# Altium schematic sheet p1.SchDoc
size A4
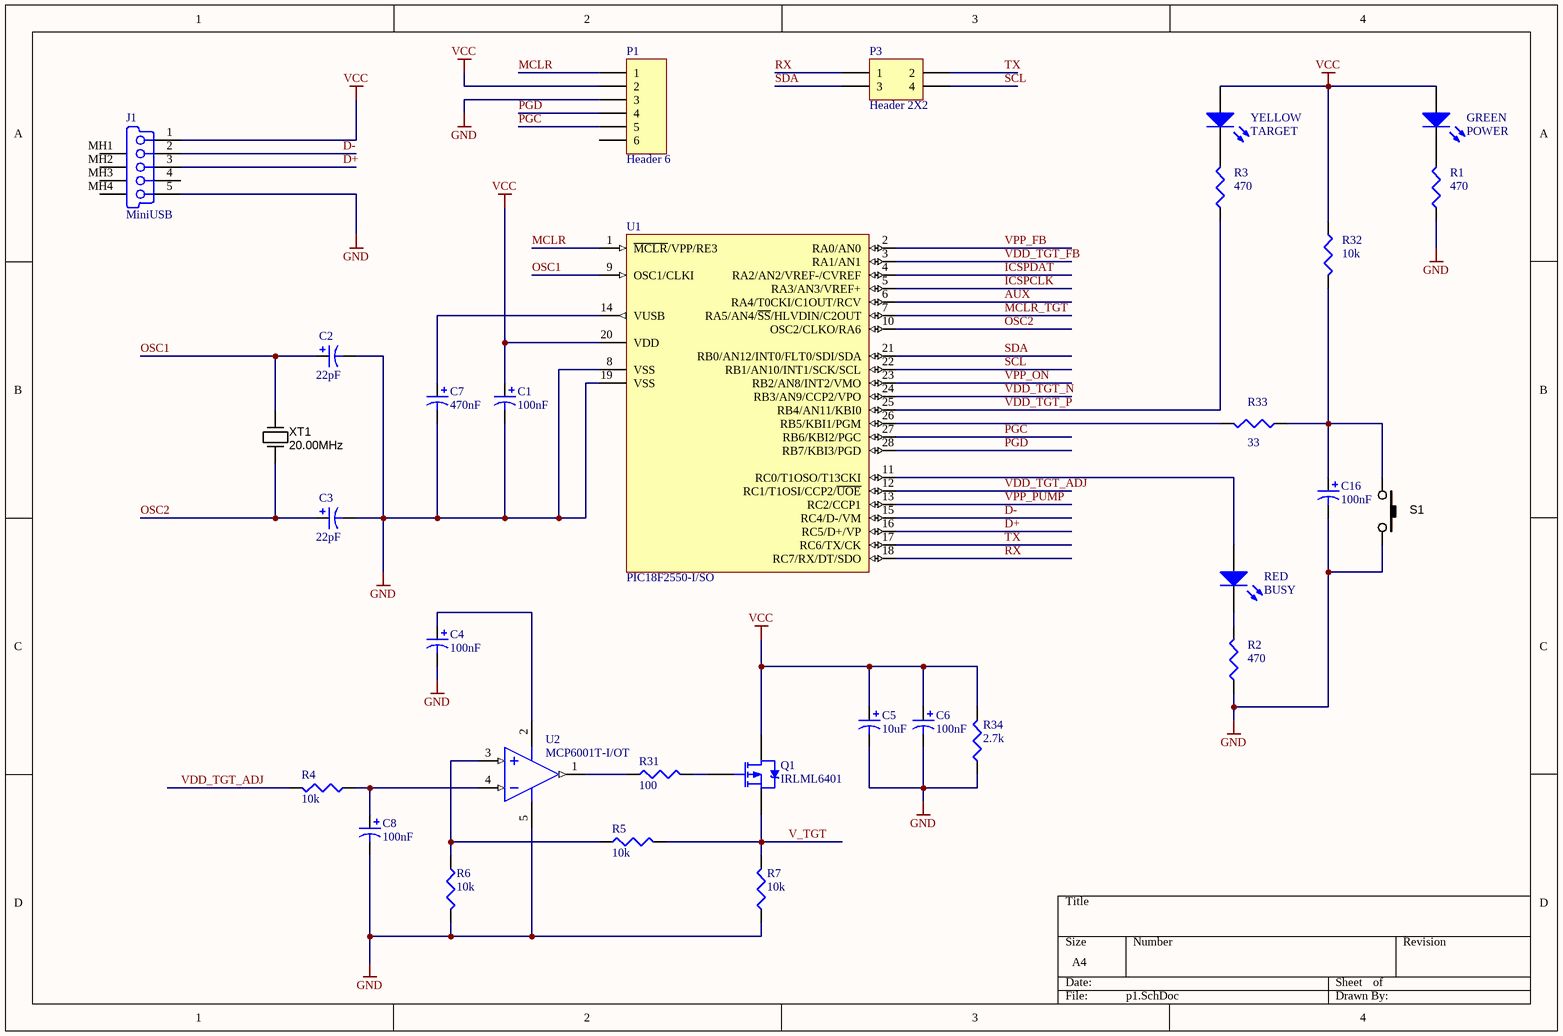
[diagram p0: p1.SchDoc]

## Parts
C1  value 100nF  [C0805]  (hidden comment: Cap Pol3)
C2  value 22pF  [C0805]  (hidden comment: Cap Pol3)
C3  value 22pF  [C0805]  (hidden comment: Cap Pol3)
C4  value 100nF  [C0805]  (hidden comment: Cap Pol3)
C5  value 10uF  [C0805]  (hidden comment: Cap Pol3)
C6  value 100nF  [C0805]  (hidden comment: Cap Pol3)
C7  value 470nF  [C0805]  (hidden comment: Cap Pol3)
C8  value 100nF  [C0805]  (hidden comment: Cap Pol3)
C16  value 100nF  [C0805]  (hidden comment: Cap Pol3)
GREEN  POWER  [3.5X2.8X1.9]
J1  MiniUSB  [microusb]
P1  Header 6  [HDR1X6]
P3  Header 2X2  [HDR2X2]
Q1  IRLML6401  [Micro3_N]
R1  value 470  [RESC2012X70N]  (hidden comment: Res3)
R2  value 470  [RESC2012X70N]  (hidden comment: Res3)
R3  value 470  [RESC2012X70N]  (hidden comment: Res3)
R4  value 10k  [RESC2012X70N]  (hidden comment: Res3)
R5  value 10k  [RESC2012X70N]  (hidden comment: Res3)
R6  value 10k  [RESC2012X70N]  (hidden comment: Res3)
R7  value 10k  [RESC2012X70N]  (hidden comment: Res3)
R31  value 100  [RESC2012X70N]  (hidden comment: Res3)
R32  value 10k  [RESC2012X70N]  (hidden comment: Res3)
R33  value 33  [RESC2012X70N]  (hidden comment: Res3)
R34  value 2.7k  [RESC2012X70N]  (hidden comment: Res3)
RED  BUSY  [3.5X2.8X1.9]
S1  TS-1143S-WP  [TS-1143S]  (value not drawn)
U1  PIC18F2550-I/SO  [SOIC-SO28_N]
U2  MCP6001T-I/OT  [SOT-23-OT5_N]
XT1  20.00MHz  [CRYSTAL_HC49-US-SM]
YELLOW  TARGET  [3.5X2.8X1.9]

## Nets
GND: C1.2 C2.2 C3.2 C4.2 C5.2 C6.2 C7.2 C8.2 C16.2 J1.5(GND) P1.3 R1.1 R2.1 R6.2 R7.1 R34.1 S1.2 U1.8(VSS) U1.19(VSS) U2.5(VDD)
VCC: C1.1 C5.1 C6.1 GREEN.1(A) J1.1(V_BUS_(5V)) P1.2 Q1.3(D) R32.1 R34.2 U1.20(VDD) YELLOW.1(A)
AUX: U1.6(RA4/T0CKI/C1OUT/RCV)
D+: J1.3(D+) U1.16(RC5/D+/VP)
D-: J1.2(D-) U1.15(RC4/D-/VM)
ICSPCLK: U1.5(RA3/AN3/VREF+)
ICSPDAT: U1.4(RA2/AN2/VREF-/CVREF)
MCLR: P1.1 U1.1(~{MCLR}/VPP/RE3)
MCLR_TGT: U1.7(RA5/AN4/~{SS}/HLVDIN/C2OUT)
OSC1: C2.1 U1.9(OSC1/CLKI) XT1.2(OUT)
OSC2: C3.1 U1.10(OSC2/CLKO/RA6) XT1.1(IN)
PGC: P1.5 U1.27(RB6/KBI2/PGC)
PGD: P1.4 U1.28(RB7/KBI3/PGD)
RX: P3.1 U1.18(RC7/RX/DT/SDO)
SCL: P3.4 U1.22(RB1/AN10/INT1/SCK/SCL)
SDA: P3.3 U1.21(RB0/AN12/INT0/FLT0/SDI/SDA)
TX: P3.2 U1.17(RC6/TX/CK)
V_TGT: Q1.2(S) R5.2 R7.2
VDD_TGT_ADJ: R4.2 U1.12(RC1/T1OSI/CCP2/~{UOE})
VDD_TGT_FB: U1.3(RA1/AN1)
VDD_TGT_N: U1.24(RB3/AN9/CCP2/VPO)
VDD_TGT_P: R3.1 U1.25(RB4/AN11/KBI0)
VPP_FB: U1.2(RA0/AN0)
VPP_ON: U1.23(RB2/AN8/INT2/VMO)
VPP_PUMP: U1.13(RC2/CCP1)
NetC4_1: C4.1 U2.2(VSS)
NetC7_1: C7.1 U1.14(VUSB)
NetC8_1: C8.1 R4.1 U2.4(VIN-)
NetC16_1: C16.1 R32.2 R33.1 S1.1
NetGREEN_2: GREEN.2(K) R1.2
NetQ1_1: Q1.1(G) R31.2
NetR2_2: R2.2 RED.2(K)
NetR3_2: R3.2 YELLOW.2(K)
NetR5_1: R5.1 R6.1 U2.3(VIN+)
NetR31_1: R31.1 U2.1(VOUT)
NetR33_2: R33.2 U1.26(RB5/KBI1/PGM)
NetRED_1: RED.1(A) U1.11(RC0/T1OSO/T13CKI)

Not connected (* = marked no-connect by the designer): J1 4(NC) MH1(Tab) MH2(Tab) MH3(Tab) MH4(Tab); P1 6

## Library data of the parts
C1-C8 C16 = Cap Pol3: Polarized Capacitor (Surface Mount); Published: 8-Jun-2000; LatestRevisionDate: 29-May-2009; LatestRevisionNote: IPC-7351 Footprint Added.; PackageReference: C0805; Publisher: Altium Limited; PackageDescription: Chip Capacitor; Supplier Part Number 1: *
GREEN RED YELLOW = LED3: Typical BLUE SiC LED; Published: 8-Jun-2000; LatestRevisionDate: 17-Dec-2003; LatestRevisionNote: PCB Footprint replaced.; DatasheetVersion: 16-Apr-2002; PackageVersion: 16-Apr-2002; PackageReference: 3.5X2.8X1.9; Publisher: Altium Limited; PackageDescription: SM LED; 2 C-Bend Leads; Body 3.5 x 2.8 x 1.9 mm, inc leads (LxWxH typ); Supplier 1: Digi-Key
  GREEN: Supplier Part Number 1: 732-4997-1-ND
  RED: Supplier Part Number 1: 732-5000-1-ND
  YELLOW: Supplier Part Number 1: 732-4995-1-ND
J1 = MicroUSB: USB On-The-Go (OTG) Mini-B Receptacle, Right Angle, SMT, 0.80mm (.031") Pitch, Solder Tabs with Back Cover, Recessed Type; PCB_Layout: Complies with Manufacturer's Recommendation.; Published: 21-Sep-2007; DatasheetVersion: revA, May-2004; PackageVersion: May-2004; PackageReference: 481900001; Publisher: Altium Limited; PackageDescription: USB Mini-B, Sinking Type, SM; 5 Position; Right Angle, Body 11.45 x 11.8 x 3.9 mm (LxWxH); ComponentLink1Description: Manufacturer Link; ComponentLink1URL: http://www.molex.com/; ComponentLink2Description: Datasheet; ComponentLink2URL: http://www.molex.com/cmc_upload/0/000/895/958/SD-48190-001RevA.pdf; Supplier Part Number 1: WM17122CT-ND; Supplier 1: Digi-Key
P1 = Header 6: Header, 6-Pin; LatestRevisionDate: 17-Jul-2002; LatestRevisionNote: Re-released for DXP Platform.; Publisher: Altium Limited; Supplier Part Number 1: S5481-ND; Supplier 1: Digi-Key
P3 = Header 2X2: Header, 2-Pin, Dual row; LatestRevisionDate: 17-Jul-2002; LatestRevisionNote: Re-released for DXP Platform.; Publisher: Altium Limited; Supplier Part Number 1: 609-3242-ND; Supplier 1: Digi-Key
Q1 = IRLML6401: HEXFET Power MOSFET; Published: 17-Sep-2003; DatasheetVersion: 2-Jul-2001; PackageVersion: Jul-2001; PackageReference: Micro3; Publisher: Altium Limited; PackageDescription: 3-Pin SOT-23 Package 0.95 mm Pitch, 2.3 mm Lead Span; ComponentLink1Description: Manufacturer Link; ComponentLink1URL: http://www.irf.com/; ComponentLink2Description: Datasheet; ComponentLink2URL: http://www.irf.com/product-info/datasheets/data/IRLML6401.pdf; Supplier Part Number 1: IRLML6401PBFCT-ND; Supplier 1: Digi-Key
R1-R7 R31-R34 = Res3: Resistor; Published: 8-Jun-2000; LatestRevisionDate: 29-May-2009; LatestRevisionNote: IPC-7351 Footprint Added.; PackageReference: J1-0603; Publisher: Altium Limited; PackageDescription: Chip Resistor; Supplier Part Number 1: *
S1 = SW_SMD_PB_4.3mm: Switch SMD Tact 4.3mm Stem; Manufacturer 1: Bond-Tact; Manufacturer Part Number 1: TS-1143S-WP-200; SCDType: spec; Function: On/Off; Package / Case: 6.5x6.5mm; 4.3mm stem; Supplier Part Number 1: CKN10304CT-ND; Supplier 1: Digi-Key
U1 = PIC18F2550-I/SO: High Performance, Enhanced Flash, USB Microcontroller with nanoWatt Technology, 32K Flash, 28-Pin SOIC, Industrial Temperature Range; Published: 29-Jan-2009; LatestRevisionDate: 02-Dec-2009; LatestRevisionNote: Updated to datasheet revision E, Aug-2008; DatasheetVersion: revE, Aug-2008; PackageVersion: revBB, Aug-2009; PackageReference: SOIC-SO28; Publisher: Altium Limited; PackageDescription: 28-Lead Plastic Small Outline (SO) - Wide 7.50mm Body [SOIC]; Supplier 1: Digi-Key; Supplier Part Number 1: PIC18F2550-I/SO-ND; Supplier 2: Farnell; Supplier Part Number 2: 1660053; Supplier 3: Farnell; Supplier Part Number 3: 9321268; Code_JEDEC: MS-013; ComponentLink1Description: Datasheet; ComponentLink1URL: http://ww1.microchip.com/downloads/en/DeviceDoc/39632e.pdf; ComponentLink2Description: Packaging Specification; ComponentLink2URL: http://www.microchip.com/stellent/groups/techpub_sg/documents/packagingspec/en012702.pdf; ComponentLink3Description: Microchip.com Home; ComponentLink3URL: http://www.microchip.com/
U2 = MCP6001T-I/OT: 1 MHz, Low-Power Operational Amplifier, 5-Pin SOT-23, Industrial Temperature, Tape and Reel; Published: 29-Jan-2009; LatestRevisionDate: 02-Dec-2009; LatestRevisionNote: Updated to datasheet revision J, Nov-2009; DatasheetVersion: revJ, Nov-2009; PackageVersion: revBB, Aug-2009; PackageReference: SOT-23-OT5; Publisher: Altium Limited; PackageDescription: 5-Lead Plastic Small Outline Transistor (OT) [SOT-23]; Supplier 1: Digi-Key; Supplier Part Number 1: MCP6001T-I/OTCT-ND; Supplier 2: Digi-Key; Supplier Part Number 2: MCP6001T-I/OTCT-ND; Supplier 3: Digi-Key; Supplier Part Number 3: MCP6001T-I/OTDKR-ND; Supplier 4: Farnell; Supplier Part Number 4: 4974992RL; Supplier 5: Farnell; Supplier Part Number 5: 4974992; Code_IPC: SOT23-5; ComponentLink1Description: Datasheet; ComponentLink1URL: http://ww1.microchip.com/downloads/en/DeviceDoc/21733j.pdf; ComponentLink2Description: Packaging Specification; ComponentLink2URL: http://www.microchip.com/stellent/groups/techpub_sg/documents/packagingspec/en012702.pdf; ComponentLink3Description: Microchip.com Home; ComponentLink3URL: http://www.microchip.com/
XT1 = Crystal_6MHz_HC49/US: Resonator Ceramic 20.00 MHz 30ppm; Manufacturer 1: CTS-Frequency Controls; Manufacturer Part Number 1: ATS060BSM-1; Frequency: 20MHz; Frequency Stability: ±50ppm; Load Capacitance: 18pF; Operating Mode: Fundamental; Parameter Name: 0.169" (4.30mm); SCDType: spec; Package / Case: HC49/US-SM; Ratings: 20.00 MHz; Supplier 1: Digi-Key; Supplier Part Number 1: XC1254CT-ND; Type: MHz Crystal; Frequency Tolerance: ±30ppm; Operating Temperature: -20°C ~ 70°C; Mounting Type: Surface Mount; Size / Dimension: 0.437" L x 0.190" W (11.10mm x 4.83mm); ComponentLink1URL: http://www.ctscorp.com/components/Datasheets/008-0309-0.pdf; ComponentLink1Description: http://www.ctscorp.com/components/Datasheets/008-0309-0.pdf